# EasyEDA Pro project LisaFPGA Rev 2 EasyEDA Project.epro, schematic Twiggy Breakout Schematic
Board Name: Twiggy Breakout; Create Date: 2026-01-15; Page Name: Twiggy Breakout; Project Name: LisaFPGA; Schematic Name: Twiggy Breakout Schematic; Update Date: 2026-01-15; Company: EasyEDA.com; Page Size: A4; Version: V1.0
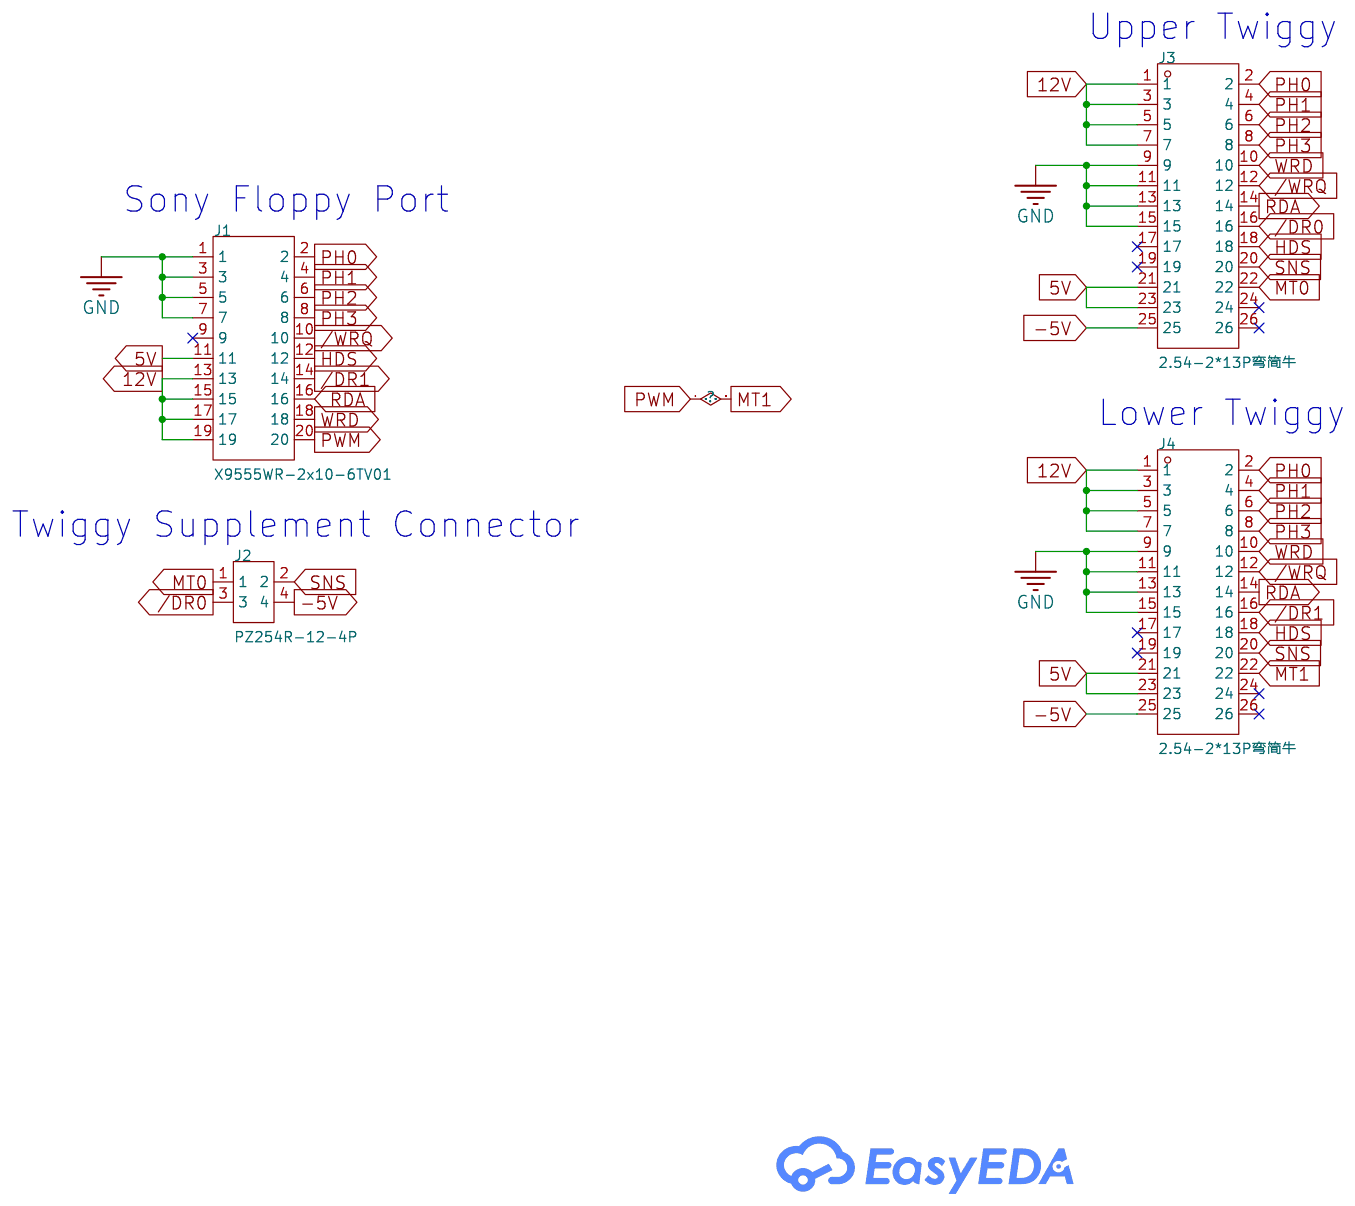
[diagram p0: schematic sheet]

## Parts
J1  X9555WR-2x10-6TV01  [CONN-TH_20P-P2.54_XKB_X9555WR-2X10-6TV01]
J2  PZ254R-12-4P  [HDR-TH_4P-P2.54-H-M-R2-C2-S2.54]
J3  2.54-2*13P弯简牛  [IDC-TH_26P-P2.54_BOOMELE-2X13P-2.54MM-H]
J4  2.54-2*13P弯简牛  [IDC-TH_26P-P2.54_BOOMELE-2X13P-2.54MM-H]

## Library data of the parts
J1 = X9555WR-2x10-6TV01: Pins Structure:2x10P Pitch:2.54mm Mounting Style:Right-Angle Reference Series:- Number of Pins:20P Number of Rows:2 Number of PINs Per Row:10 Row Spacing:2.54mm Current Rating (Max):3A Contact Material:Brass Contact Plating:Tin Operating Temperature Range; LCSC Part Name: 2x10P 间距:2.54mm 弯插; Supplier Part: C2884508; Manufacturer: XKB Connection(中国星坤); Supplier Footprint: 弯插,P=2.54mm; JLCPCB Part Class: Extended Part; Datasheet: https://atta.szlcsc.com/upload/public/pdf/source/20211009/ED69AC5D0B165AFEE3838F4DF324EF6E.pdf; Supplier: LCSC; Pins Structure: 2x10P; Pitch: 2.54mm; Mounting Style: Right-Angle; Number of Pins: 20P; Number of Rows: 2; Number of PINs Per Row: 10; Row Spacing: 2.54mm; Current Rating (Max): 3A; Contact Material: Brass; Contact Plating: Tin
J2 = PZ254R-12-4P: Pin Structure:2x2P Pitch:2.54mm Row Spacing:2.54mm Circluar Pins/Square Pins:Policy Mounting Type:Right-Angle Number of Rows:Double Row Number of Pins:4P Current Rating:- Voltage Rating (Max):- Length of Mating Pin:6mm Insulation Height:2.5mm Contact Mate; LCSC Part Name: 2x2P 间距:2.54mm 方针 弯插; Supplier Part: C492430; Manufacturer: XFCN(兴飞); Supplier Footprint: 弯插,P=2.54mm; JLCPCB Part Class: Extended Part; Datasheet: https://atta.szlcsc.com/upload/public/pdf/source/20200309/C492430_40F61060098E2A512B5822C8CF53ABE1.pdf; Supplier: LCSC; Pin Structure: 2x2P; Pitch: 2.54mm; Row Spacing: 2.54mm; Circluar Pins/Square Pins: Policy; Mounting Type: Right-Angle; Number of Rows: Double Row; Number of Pins: 4P; Length of Mating Pin: 6mm; Insulation Height: 2.5mm; Contact Material: Brass; Operating Temperature: -40℃~+105℃; Color: Black
J3 J4 = 2.54-2*13P弯简牛: Connector Type:IDC Header Pitch:2.54mm Number of Positions or Pins:2x13P Current Rating:3A Holder Type:Right Angle Row Spacing:2.54mm Number of Rows:2 Number of PINs Per Row:13 Contact Material:Brass Contact Plating:- Operating Temperature:-40℃~+105℃ Oper; LCSC Part Name: 2.54mm 2x13P 排数:2 每排P数:13; Supplier Part: C21167; Manufacturer: BOOMELE(博穆精密); Supplier Footprint: 弯插,P=2.54mm; JLCPCB Part Class: Extended Part; Datasheet: https://item.szlcsc.com/datasheet/2.54-2*13P%25E5%25BC%25AF%25E7%25AE%2580%25E7%2589%259B/21881.html; Supplier: LCSC; Connector Type: IDC Header; Pitch: 2.54mm; Number of Positions or Pins: 2x13P; Current Rating: 3A; Holder Type: Right Angle; Row Spacing: 2.54mm; Number of Rows: 2; Number of PINs Per Row: 13; Contact Material: Brass; Operating Temperature: -40℃~+105℃

## Nets
5V: J1.11 J3.21 J3.23 J4.21 J4.23
12V: J1.13 J1.15 J1.17 J1.19 J3.1 J3.3 J3.5 J3.7 J4.1 J4.3 J4.5 J4.7
-5V: J2.4 J3.25 J4.25
GND: J1.1 J1.3 J1.5 J1.7 J3.9 J3.11 J3.13 J3.15 J4.9 J4.11 J4.13 J4.15
/DR0: J2.3 J3.16
/DR1: J1.14 J4.16
/WRQ: J1.10 J3.12 J4.12
HDS: J1.12 J3.18 J4.18
MT0: J2.1 J3.22
MT1: J1.20 J4.22
PH0: J1.2 J3.2 J4.2
PH1: J1.4 J3.4 J4.4
PH2: J1.6 J3.6 J4.6
PH3: J1.8 J3.8 J4.8
RDA: J1.16 J3.14 J4.14
SNS: J2.2 J3.20 J4.20
WRD: J1.18 J3.10 J4.10

Not connected (* = marked no-connect by the designer): J1 9*; J3 17* 19* 24* 26*; J4 17* 19* 24* 26*

## Notes on the sheet
- Upper Twiggy
- Sony Floppy Port
- Lower Twiggy
- Twiggy Supplement Connector
